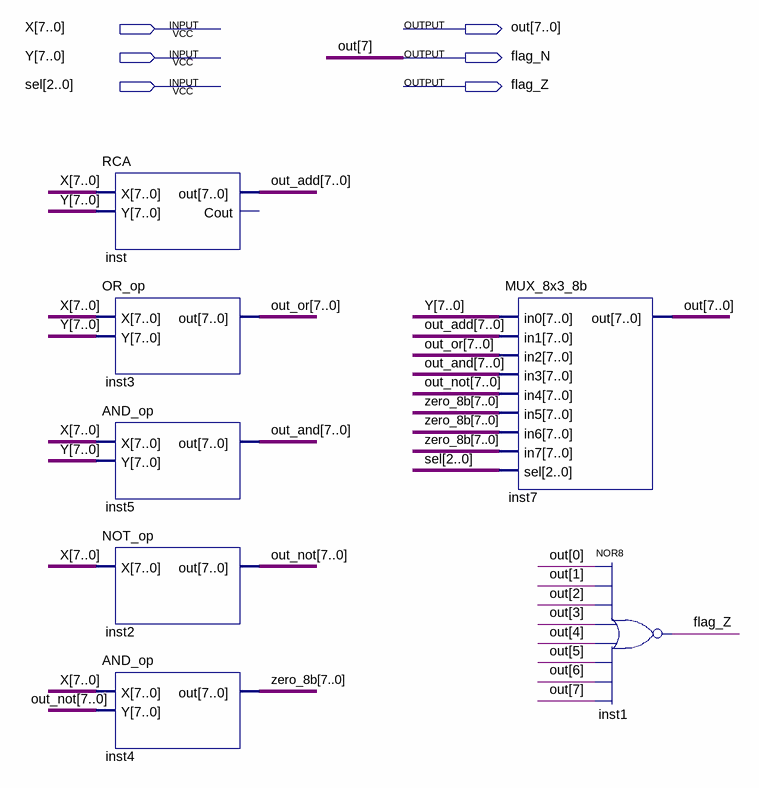
[diagram p0: schematic sheet]
// Quartus schematic ULA.bdf as structural Verilog: 7 symbols, 6 pins
module ULA (
  input  [7:0] X,
  input  [7:0] Y,
  input  [2:0] sel,
  output [7:0] out,
  output flag_N,
  output flag_Z
);

  wire [7:0] out_add, out_and, out_not, out_or, zero_8b;

  RCA inst (.X(X), .Y(Y), .out(out_add));  // open: Cout
  OR_op inst3 (.X(X), .Y(Y), .out(out_or));
  AND_op inst5 (.X(X), .Y(Y), .out(out_and));
  NOT_op inst2 (.X(X), .out(out_not));
  AND_op inst4 (.X(X), .Y(out_not), .out(zero_8b));
  MUX_8x3_8b inst7 (
    .in0(Y), .in1(out_add), .in2(out_or), .in3(out_and), .in4(out_not), .in5(zero_8b), .in6(zero_8b),
    .in7(zero_8b), .sel(sel), .out({flag_N, out[6:0]}));
  nor inst1 (flag_Z, out[0], out[1], out[2], out[3], out[4], out[5], out[6], flag_N);

  assign out[7] = flag_N;
endmodule
